# Altium project Brake_Light.PrjPcb
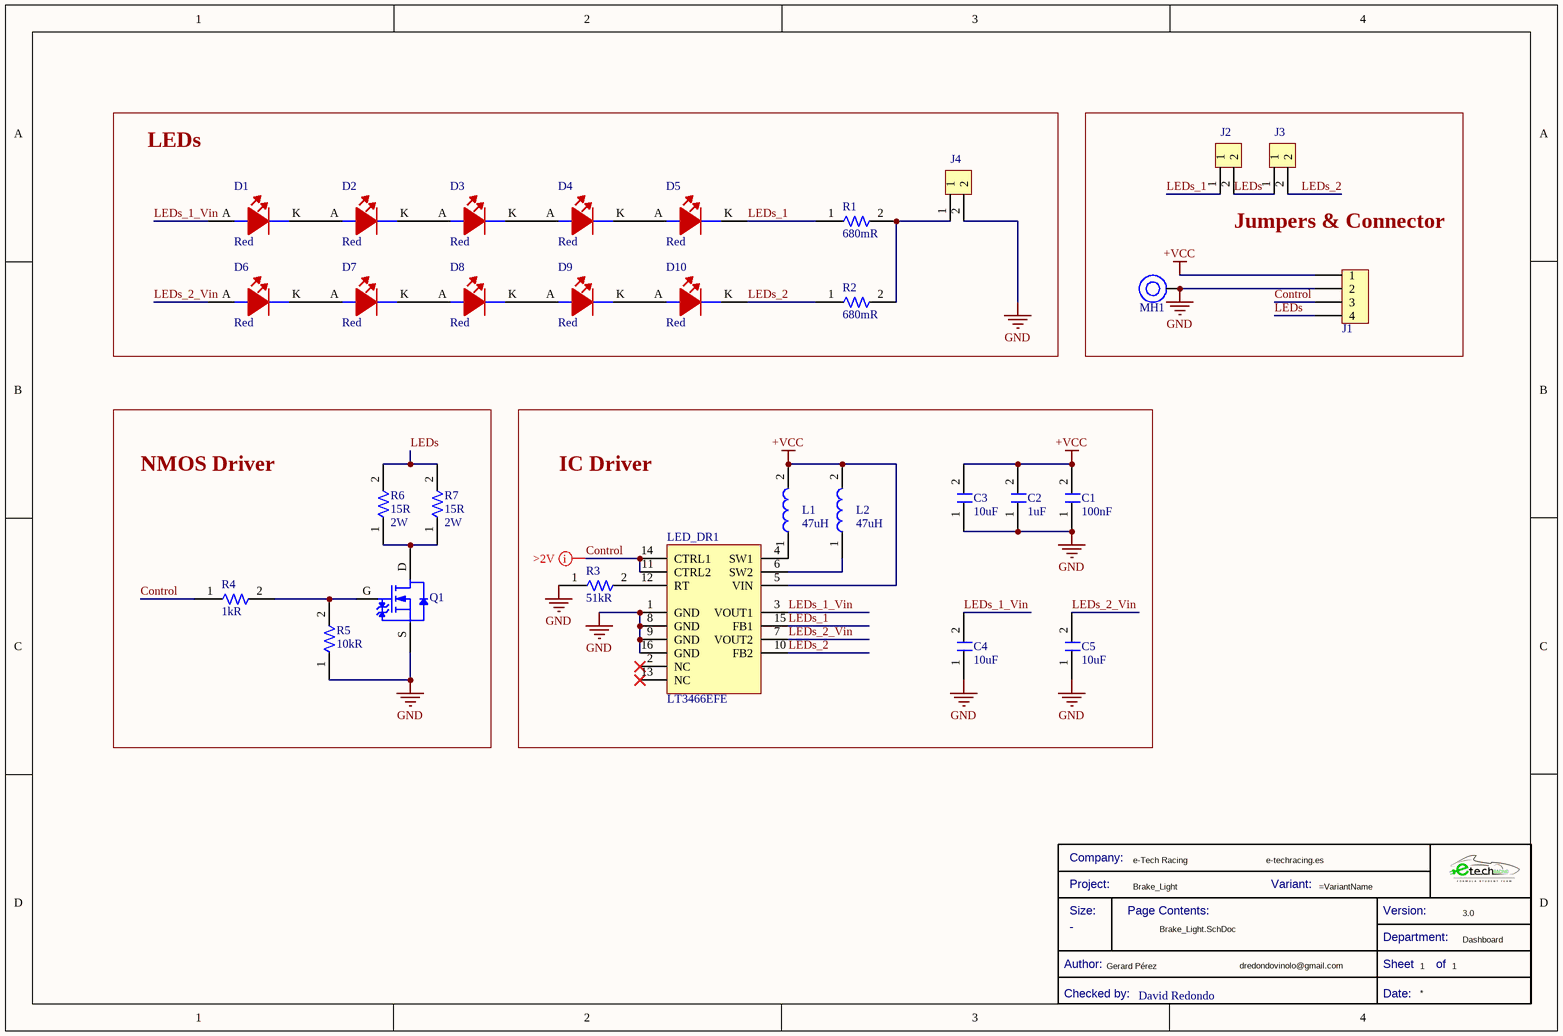
[diagram p0: Brake_Light.SchDoc]
Company: e-Tech Racing; Department: Dashboard; DesignedByURL: e-techracing.es; DesignerMail: dredondovinolo@gmail.com; DesignerName: Gerard Pérez; Project: Brake_Light; ReviewerName: David Redondo; Version: 3.0
1 sheet, 32 parts. Net scope: global (net labels, ports and power ports of the same name join across sheets).
Board file: Brake_Light.PcbDoc

## Sheet Brake_Light.SchDoc
size A4; SheetNumber: 1; SheetTotal: 1

### Parts
*?  Checked by:: David Redondo  (hidden comment: Title Block_template)  (graphical)
C1  Capacitance: 100nF  [C0805FNPC-R]  (hidden comment: 885012207098)
C2  Capacitance: 1uF  [C0805FNPC-R]  (hidden comment: 885012207103)
C3  Capacitance: 10uF  [C10u-50V-1210FNPMLCC-X7R]  (hidden comment: GRJ32ER71H106KE11L)
C4  Capacitance: 10uF  [C10u-50V-1210FNPMLCC-X7R]  (hidden comment: GRJ32ER71H106KE11L)
C5  Capacitance: 10uF  [C10u-50V-1210FNPMLCC-X7R]  (hidden comment: GRJ32ER71H106KE11L)
D1  Color: Red  [LED_3535_WE]  (hidden comment: 150353RS74500)
D2  Color: Red  [LED_3535_WE]  (hidden comment: 150353RS74500)
D3  Color: Red  [LED_3535_WE]  (hidden comment: 150353RS74500)
D4  Color: Red  [LED_3535_WE]  (hidden comment: 150353RS74500)
D5  Color: Red  [LED_3535_WE]  (hidden comment: 150353RS74500)
D6  Color: Red  [LED_3535_WE]  (hidden comment: 150353RS74500)
D7  Color: Red  [LED_3535_WE]  (hidden comment: 150353RS74500)
D8  Color: Red  [LED_3535_WE]  (hidden comment: 150353RS74500)
D9  Color: Red  [LED_3535_WE]  (hidden comment: 150353RS74500)
D10  Color: Red  [LED_3535_WE]  (hidden comment: 150353RS74500)
J1  1053131204  [J_NanoFit_1x4]  (value not drawn)
J2  61300211121  [J_Pinheader_1x2]  (value not drawn)
J3  61300211121  [J_Pinheader_1x2]  (value not drawn)
J4  61300211121  [J_Pinheader_1x2]  (value not drawn)
L1  Inductance: 47uH  [L_47u-490mA_CF]  (hidden comment: CDC5D23BNP-470KC)
L2  Inductance: 47uH  [L_47u-490mA_CF]  (hidden comment: CDC5D23BNP-470KC)
LED_DR1  Supplier Part Number 1: LT3466EFE  [LED_Driver_300mA_2Outputs]  (hidden comment: LT3466)
MH1  Mounting_Hole_M3  [Mounting_Hole_M3]  (value not drawn)
Q1  SQ2318BES-T1_GE3  [TRT-NCH-D2PAK]  (value not drawn)
R1  Resistance: 680mR  [R1206FTK-W]  (hidden comment: R68m-1206FTK)
R2  Resistance: 680mR  [R1206FTK-W]  (hidden comment: R68m-1206FTK)
R3  Resistance: 51kR  [R1206FTK-W]  (hidden comment: CRCW120610K0FKEA)
R4  Resistance: 1kR  [R0805FTK]  (hidden comment: CR0805-JW-102ELF)
R5  Resistance: 10kR  [R0805FTK]  (hidden comment: CR0805-JW-103ELF)
R6  value 15R  Max Power Dissipation: 2W  [R2512FTK]  (hidden comment: 352115RFT)
R7  value 15R  Max Power Dissipation: 2W  [R2512FTK]  (hidden comment: 352115RFT)

### Blocks framed on the sheet
LEDs: D1-D10 J4 R1 R2
Jumpers & Connector: J1-J3 MH1
NMOS Driver: Q1 R4-R7
IC Driver: C1-C5 L1 L2 LED_DR1 R3

### Nets
+VCC: C1.2 C2.2 C3.2 J1.1 L1.2 L2.2 LED_DR1.5(VIN)
GND: C1.1 C2.1 C3.1 C4.1 C5.1 J1.2 J4.2 LED_DR1.1(GND) LED_DR1.8(GND) LED_DR1.9(GND) LED_DR1.16(GND) MH1.1 Q1.S R3.1 R5.1
Control: J1.3 LED_DR1.11(CTRL2) LED_DR1.14(CTRL1) R4.1
LEDs: J1.4 J2.2 J3.1 R6.2 R7.2
LEDs_1: D5.K J2.1 LED_DR1.15(FB1) R1.1
LEDs_1_Vin: C4.2 D1.A LED_DR1.3(VOUT1)
LEDs_2: D10.K J3.2 LED_DR1.10(FB2) R2.1
LEDs_2_Vin: C5.2 D6.A LED_DR1.7(VOUT2)
NetD1_K: D1.K D2.A
NetD2_K: D2.K D3.A
NetD3_K: D3.K D4.A
NetD4_K: D4.K D5.A
NetD6_K: D6.K D7.A
NetD7_K: D7.K D8.A
NetD8_K: D8.K D9.A
NetD9_K: D9.K D10.A
NetJ4_1: J4.1 R1.2 R2.2
NetL1_1: L1.1 LED_DR1.4(SW1)
NetL2_1: L2.1 LED_DR1.6(SW2)
NetLED_DR1_12: LED_DR1.12(RT) R3.2
NetQ1_D: Q1.D R6.1 R7.1
NetQ1_G: Q1.G R4.2 R5.2

Not connected (* = marked no-connect by the designer): LED_DR1 2(NC)* 13(NC)*

### Layout directives
mark named >2V: Control

### Notes on the sheet
- (in symbol Title Block_template) Company:; Project:; Variant:; Size:; Page Contents:; Version:; Department:; Author:; Sheet; of; Checked by:; Date:

### Library data of the parts
*? = Title Block_template: Standard Title Block; .Creator: GP; Category: Title Block; .PCBcheck: GP; .SCHcheck: GP; Size: -
C1 = C100n-50V-0805FNPC-X7R: Cap, 0.1ΜF, 50V, 10%, X7R, 0805; Manufacturer 1: Wurth Electronics; .Creator: DR; Supplier 1: RSComponents; Manufacturer Part Number 1: 885012207098; RoHS: Yes; Category: Ceramic Capacitors; Stock 1: 8000; Pricing 1: 100=0,10200, 500=0,07100, 2000=0,06100 (GBP); Mount: Surface Mount; Case/Package: 0805; Case Code (Metric): 2012; Case Code (Imperial): 0805; Min Operating Temperature: -55°C; Max Operating Temperature: 125°C; Packaging: Cut Tape; Voltage Rating: 50V; Dielectric: X7R; Tolerance: 10%; Voltage Rating (DC): 50V; Length: 0.079inch; Width: 0.049inch; Thickness: 0.035inch; REACH SVHC: Unknown; RoHS Compliant: Yes; ComponentLink1URL: http://www.farnell.com/datasheets/1958498.pdf?src-supplier=Farnell; ComponentLink1Description: http://www.farnell.com/datasheets/1958498.pdf?src-supplier=Farnell; ComponentLink2URL: http://www.farnell.com/datasheets/1958498.pdf?src-supplier=Element14; ComponentLink2Description: http://www.farnell.com/datasheets/1958498.pdf?src-supplier=Element14; ComponentLink3URL: https://katalog.we-online.de/pbs/datasheet/885012207098.pdf?src-supplier=Digi-Key; ComponentLink3Description: https://katalog.we-online.de/pbs/datasheet/885012207098.pdf?src-supplier=Digi-Key; ComponentLink4URL: http://www.farnell.com/datasheets/1958498.pdf?src-supplier=Newark; ComponentLink4Description: http://www.farnell.com/datasheets/1958498.pdf?src-supplier=Newark; Supplier Part Number 1: 1813493
C2 = C1u-50V-0805FNPC-X7R: Multilayer Ceramic Capacitor, Wcap-Csgp Series, 1 F, 10%, X7R, 50 V, 0805 [2012 Metric] Rohs Compliant: Yes; Manufacturer 1: Wurth Electronics; Voltage Rating: 50V; .Creator: GP; Supplier 1: RSComponents; Manufacturer Part Number 1: 885012207103; RoHS: Yes; Category: Ceramic Capacitors; Stock 1: 5100; Pricing 1: 50=0,27200, 250=0,25300, 500=0,22800, 1250=0,20100, 2500=0,17100 (GBP); Mount: Surface Mount; Case/Package: 0805; Case Code (Metric): 2012; Case Code (Imperial): 0805; Min Operating Temperature: -55°C; Max Operating Temperature: 85°C; Packaging: Cut Tape; Dielectric: X7R; Tolerance: 10%; Voltage Rating (DC): 50V; Length: 0.079inch; Width: 0.049inch; Thickness: 0.053inch; REACH SVHC: Unknown; RoHS Compliant: Yes; ComponentLink1URL: http://www.farnell.com/datasheets/1958501.pdf?src-supplier=Farnell; ComponentLink1Description: http://www.farnell.com/datasheets/1958501.pdf?src-supplier=Farnell; ComponentLink2URL: http://www.farnell.com/datasheets/1958501.pdf?src-supplier=Element14; ComponentLink2Description: http://www.farnell.com/datasheets/1958501.pdf?src-supplier=Element14; ComponentLink3URL: https://katalog.we-online.de/pbs/datasheet/885012107003.pdf?src-supplier=Digi-Key; ComponentLink3Description: https://katalog.we-online.de/pbs/datasheet/885012107003.pdf?src-supplier=Digi-Key; ComponentLink4URL: http://www.farnell.com/datasheets/1958501.pdf?src-supplier=Newark; ComponentLink4Description: http://www.farnell.com/datasheets/1958501.pdf?src-supplier=Newark; Supplier Part Number 1: 1813523
C3-C5 = C10u-50V-1210FNPMLCC-X7R: Multilayer Ceramic Capacitors MLCC - SMD/SMT 1210 10uF 50volts X7R +/-10% Soft Term; Manufacturer: Murata; Voltage Rating: 50V; Tolerance: 10%; .Creator: DR; Supplier 1: Avnet; Manufacturer Part Number: GRJ32ER71H106KE11L; RoHS: Yes; Category: Ceramic Capacitors; Stock 1: 19000; Pricing 1: 1000=0,33327, 2000=0,32389, 4000=0,31450, 6000=0,30511, 8000=0,29572 (USD); Mount: Surface Mount; Case/Package: 1210; Case Code (Metric): 3225; Case Code (Imperial): 1210; Min Operating Temperature: -55°C; Max Operating Temperature: 125°C; Packaging: Tape and Reel; Features: Soft Termination; Length: 0.126inch; Width: 0.098inch; Thickness: 0.11inch; RoHS Compliant: Yes; ComponentLink1URL: https://eu.mouser.com/datasheet/2/281/GRJ32ER71H106KE11_01-1977929.pdf; ComponentLink1Description: Datasheet; Supplier Part Number 1: GRJ32ER71H106KE11L
D1-D10 = LEDRS-3535-55: High Brightness Led, Wl-Smdc Series, 625 Nm, Red, 55 Lm, 350 Ma; Manufacturer: Wurth Electronics; Forward Current: 700mA; Wavelength: 625nm; Test Temperature: 25°C; Viewing Angle: 125°; Thermal Resistance of Package: 10°C/W; Luminous Flux: 55lm; Test Current: 350mA; Forward Voltage: 2.2V; .Creator: GP; Supplier 1: RSComponents; Manufacturer Part Number: 150353RS74500; RoHS: Yes; Stock 1: 1; Pricing 1: 5=1,40500 (USD); Mount: Surface Mount; Case/Package: SMD/SMT; Packaging: Cut Tape; Max Current Rating: 700mA; REACH SVHC: Unknown; RoHS Compliant: Yes; ComponentLink1URL: http://www.farnell.com/datasheets/1886833.pdf?src-supplier=Farnell; ComponentLink1Description: http://www.farnell.com/datasheets/1886833.pdf?src-supplier=Farnell; ComponentLink2URL: http://www.farnell.com/datasheets/1886833.pdf?src-supplier=Element14; ComponentLink2Description: http://www.farnell.com/datasheets/1886833.pdf?src-supplier=Element14; Supplier Part Number 1: 9008911; ComponentLink3Description: Where buy it; ComponentLink3URL: https://www.we-online.com/catalog/en/WL-SMDC?sq=150353rs74500&sp=https%3A%2F%2Fwww.we-online.com%2Fweb%2Fen%2Fwuerth_elektronik%2Fsearchpage.php%3Fsearch%3D150353rs74500#150353RS74500
J1 = J_NanoFit_1x4: Nano-Fit Right Angle Header; Through Hole; 2.50mm; Single Row; 4 Circuit; Gold Plated; Manufacturer: Molex; Manufacturer Part Number: 105313-1204; Gender: Male; .Creator: DO; Supplier 1: RSComponents; RoHS: Yes; Category: Headers and Wire Housings; Stock 1: 286; Pricing 1: 10=1,14100, 50=0,65100, 100=0,63400, 250=0,61700, 500=0,60100 (GBP); Mount: Through Hole; Contact Plating: Gold; Contact Material: Brass; Color: Black; Termination: Through Hole; Number of Rows: 1; REACH SVHC: Unknown; RoHS Compliant: Yes; ComponentLink1URL: http://www.farnell.com/datasheets/2216599.pdf?src-supplier=Farnell; ComponentLink1Description: http://www.farnell.com/datasheets/2216599.pdf?src-supplier=Farnell; ComponentLink2URL: http://www.farnell.com/datasheets/2216599.pdf?src-supplier=Element14; ComponentLink2Description: http://www.farnell.com/datasheets/2216599.pdf?src-supplier=Element14; ComponentLink3URL: http://www.farnell.com/datasheets/2216599.pdf?src-supplier=Newark; ComponentLink3Description: http://www.farnell.com/datasheets/2216599.pdf?src-supplier=Newark; ComponentLink4URL: https://www.molex.com/pdm_docs/sd/1053131102_sd.pdf?src-supplier=Digi-Key; ComponentLink4Description: https://www.molex.com/pdm_docs/sd/1053131102_sd.pdf?src-supplier=Digi-Key; Supplier Part Number 1: 1225085
J2-J4 = J_Jumper: CONN HEADER 2 POS 2.54; Manufacturer: Molex; Temperature rating: -40° to +105°C; Category type: PCB-PCB; Product name: Pin Header; Maximum current: 3 A; Maximum voltage: 250 V AC; Connections: 1x2; Current Rating: 3A; Voltage Rating: 250V; Number of Positions: 2; Gender: Male; Connector Type: Male Pin; Pitch: 0.1inch; .Creator: GP; Category: Connector; ComponentLink1Description: Datasheet; ComponentLink1URL: https://www.we-online.com/catalog/datasheet/61300211121.pdf; ComponentLink2Description: Where buy it; ComponentLink2URL: https://www.we-online.com/catalog/en/PHD_2_54_THT_PIN_HEADER_6130XX11121?sq=61300211121&sp=https%3A%2F%2Fwww.we-online.com%2Fweb%2Fen%2Fwuerth_elektronik%2Fsearchpage.php%3Fsearch%3D61300211121#61300211121; Manufacturer part number: 61300211121; Supplier: Würth Elektronik; RoHS: *; Application: Shortcircuit; Flammability: 94V-0; Orientation: Vertical; Mount: Through hole; Supplier 1: RSComponents; Stock 1: 1855; Pricing 1: 5=0,14100, 50=0,09700, 100=0,07800, 200=0,07300, 500=0,06800 (USD); Contact Plating: Gold; Housing Material: PBT; Contact Material: Copper Alloy,Copper; Color: Black; Min Operating Temperature: -40°C; Max Operating Temperature: 125°C; Number of Rows: 1; Contact Gender: Male; Packaging: Bulk; Termination: Through Hole; Number of Contacts: 2; Contact Mating Length: 0.236inch; REACH SVHC: Unknown; Lead Free: Lead Free; ComponentLink3URL: https://datasheet.ciiva.com/13619/6130xx11121-48870-13619345.pdf?src-supplier=Mouser; ComponentLink3Description: https://datasheet.ciiva.com/13619/6130xx11121-48870-13619345.pdf?src-supplier=Mouser; Supplier Part Number 1: 8281581
L1 L2 = L_47u-490mA_CF: Inductor Power Unshielded Wirewound 47uH 10% 100KHz Ferrite 490mA 546mOhm DCR T/R; Manufacturer: Sumida; DC Resistance (DCR): 546mR; .Creator: GP; Supplier 1: Mouser; Manufacturer Part Number: CDC5D23BNP-470KC; RoHS: Yes; Category: Fixed Inductors; Stock 1: 3779; Pricing 1: 1=0,95000, 10=0,71100, 50=0,71100, 100=0,59700, 1000=0,40600, 10000=0,38100 (USD); Mount: Surface Mount; Case/Package: Nonstandard; Core Material: Ferrite; Weight: 0.007584oz; Min Operating Temperature: -40°C; Max Operating Temperature: 100°C; Tolerance: 10%; Shielding: Unshielded; Packaging: Tape and Reel; Package Quantity: 2000; Current Rating: 490mA; Max DC Current: 490mA; Termination: SMD/SMT; Test Frequency: 100kHz; Series: CDC5D23B; Length: 0.228inch; Width: 5.8mm; Height: 2.5mm; Height - Seated (Max): 0.098inch; Lead Free: Lead Free; RoHS Compliant: Yes; ComponentLink1URL: http://www.mouser.com/ds/2/390/CDC5D23B-465898.pdf?src-supplier=Mouser; ComponentLink1Description: http://www.mouser.com/ds/2/390/CDC5D23B-465898.pdf?src-supplier=Mouser; ComponentLink3URL: http://products.sumida.com/products/pdf/CDC5D23B.pdf?src-supplier=Digi-Key; ComponentLink3Description: http://products.sumida.com/products/pdf/CDC5D23B.pdf?src-supplier=Digi-Key; Supplier Part Number 1: 851-CDC5D23BNP-470KC
LED_DR1 = LED_Driver_300mA_2Outputs: LT3466 - Dual Full Function White LED Step-Up Converter with Built-In Schottky Diodes; Manufacturer: Analog Devices / Linear Technology; Min Input Voltage: 2.7V; Topology: Boost; Max Supply Voltage: 24V; Number of Segments: 20; .Creator: GP; Supplier 1: Arrow Electronics; Manufacturer Part Number: LT3466EFE; RoHS: No; Number of Pins: 16; Min Operating Temperature: -40°C; Max Operating Temperature: 85°C; Min Supply Voltage: 2.7V; RoHS Compliant: No; ComponentLink1URL: https://eu.mouser.com/datasheet/2/609/3466fa-1271503.pdf; ComponentLink1Description: Datasheet; ComponentLink2Description: Where buy it; ComponentLink2URL: *
Q1 = TRT-NCH-31/100: MOSFET N-CH 100V 31A DPAK; Manufacturer 1: Infineon; Manufacturer Part Number 1: IRFR3410TRPBF; Power Dissipation: 110W; Gate to Source Voltage (Vgs): 20V; Rds On Max: 39mR; Input Capacitance: 1.69nF; Max Power Dissipation: 3W; Turn-Off Delay Time: 40ns; Turn-On Delay Time: 12ns; Threshold Voltage: 4V; Polarization: N; ComponentLink2Description: Datasheet; ComponentLink2URL: https://www.mouser.es/datasheet/2/427/sq2318bes-1868475.pdf; Supplier 1: Farnell; RoHS: Yes; Category: MOSFETs; Stock 1: 4070; Pricing 1: 1=1,20000, 10=1,08000, 100=0,84200, 500=0,69600 (EUR); Mount: Surface Mount; Case/Package: TO-252-3; Number of Pins: 3; Min Operating Temperature: -55°C; Max Operating Temperature: 175°C; Continuous Drain Current (ID): 31A; Packaging: Cut Tape; Drain to Source Voltage (Vdss): 100V; Drain to Source Resistance: 39mR; Drain to Source Breakdown Voltage: 100V; Series: HEXFET®; Max Dual Supply Voltage: 100V; Length: 0.264inch; Width: 0.245inch; Height: 0.094inch; Lead Free: Contains Lead; RoHS Compliant: Yes; Reach SVHC Compliant: Yes; Halogen Free: Halogen Free; Supplier Part Number 1: 2468036
R1 R2 = R68m-1206FTK: Thick Film Surface Mount Chip Resistor 1206 Size 0.68 Ohm 5% 0.5 W ±100 ppm/°C 2-Pin SMD T/R; Manufacturer 1: Vishay; Manufacturer Part Number 1: RCWE1206R680JKEA; Max Power Dissipation: 500mW; Supplier 1: Avnet; RoHS: Yes; Category: Chip SMD Resistors; Pricing 1: 5000=0,23581, 10000=0,22825, 20000=0,22069, 30000=0,21313, 40000=0,20488, 50000=0,19525, 500000=0,18563 (USD); Case/Package: 1206; Min Operating Temperature: -55°C; Max Operating Temperature: 155°C; Tolerance: 5%; Resistor Type: Thick Film; Packaging: Tape and Reel; Number of Terminations: 2; Temperature Coefficient: 100ppm/°C; Features: Moisture Resistant,Automotive AEC-Q200; Length: 0.122inch; Width: 0.063inch; Height: 0.028inch; Depth: 1.6mm; Military Standard: Not; RoHS Compliant: Yes; ComponentLink1URL: http://www.vishay.com/docs/20019/rcwe.pdf?src-supplier=Digi-Key; ComponentLink1Description: http://www.vishay.com/docs/20019/rcwe.pdf?src-supplier=Digi-Key; Supplier Part Number 1: RCWE1206R680JKEA
R3 = R51k-1206FTK: Res Thick Film 1206 51K Ohm 1% 1/4W ±100ppm/°C Molded SMD SMD Punched Carrier T/R; Manufacturer: Panasonic; Manufacturer Part Number: ERJ-S08F5102V; Power Rating: 250mW; Voltage Rating: 150V; Voltage Rating (DC): 200V; Current Rating: 2A; .Creator: DO; Category: Resistor; ComponentLink1Description: Datasheet; ComponentLink1URL: https://docs.rs-online.com/bca8/A700000006404581.pdf; ComponentLink2Description: Where buy it; ComponentLink2URL: https://es.rs-online.com/web/p/resistencias-de-montaje-en-superficie/6791765; Supplier 1: Mouser; RoHS: Yes; Stock 1: 4091; Pricing 1: 1=0,31000, 10=0,26700, 50=0,26700, 100=0,10700, 1000=0,05100, 10000=0,03400 (USD); Mount: Surface Mount; Case/Package: 1206; Case Code (Metric): 3216; Case Code (Imperial): 1206; Contact Plating: Tin; Min Operating Temperature: -55°C; Max Operating Temperature: 155°C; Packaging: Tape and Reel; Tolerance: 1%; Package Quantity: 5000; Resistor Type: Thick Film; Number of Terminations: 2; Temperature Coefficient: 100ppm/°C; Max Power Dissipation: 250mW; Features: Anti-Sulfur; Series: ERJ; Construction: Rectangular; Length: 3.2mm; Width: 0.063inch; Height: 0.028inch; Depth: 1.6mm; Military Standard: Not; Lead Free: Lead Free; RoHS Compliant: Yes; ComponentLink3URL: https://datasheet.ciiva.com/24023/aoa0000ce5-24023518.pdf?src-supplier=Mouser; ComponentLink3Description: https://datasheet.ciiva.com/24023/aoa0000ce5-24023518.pdf?src-supplier=Mouser; ComponentLink4URL: https://datasheet.ciiva.com/9189/aoa0000ce5-9189211.pdf?src-supplier=Avnet; ComponentLink4Description: https://datasheet.ciiva.com/9189/aoa0000ce5-9189211.pdf?src-supplier=Avnet; Supplier Part Number 1: 667-ERJ-S08F5102V
R4 = R1k-0805FTK: Res Thick Film 0805 1K Ohm 5% 1/8W ±200ppm/°C Molded SMD SMD Paper Tape on Plastic Reel; Manufacturer 1: Bourns; Voltage Rating (DC): 150V; Power Rating: 125mW; .Creator: GP; Supplier 1: Arrow Electronics; Manufacturer Part Number 1: CR0805-JW-102ELF; RoHS: Yes; Category: Chip SMD Resistors; Stock 1: 27510; Pricing 1: 1=0,05930, 10=0,03510, 25=0,01790, 100=0,00800, 250=0,00790, 500=0,00590, 1000=0,00360, 3000=0,00350, 6000=0,00250 (USD); Mount: Surface Mount; Case/Package: 0805; Number of Pins: 2; Contact Plating: Tin; Case Code (Metric): 2012; Case Code (Imperial): 0805; Min Operating Temperature: -55°C; Max Operating Temperature: 155°C; Resistor Type: Thick Film; Tolerance: 5%; Temperature Coefficient: 200ppm/°C; Features: Moisture Resistant; Package Quantity: 1; Packaging: Tape and Reel; Voltage Rating: 150V; Number of Terminations: 2; Termination: SMD/SMT; Max Power Dissipation: 125mW; Length: 2mm; Width: 1.25mm; Height: 0.5mm; Thickness: 508um; Depth: 1.25mm; Radiation Hardening: No; Lead Free: Lead Free; REACH SVHC: No SVHC; Military Standard: Not; ComponentLink1URL: https://datasheet.ciiva.com/11821/0900766b80fcdb72-11821134.pdf?src-supplier=RSComponents; ComponentLink1Description: https://datasheet.ciiva.com/11821/0900766b80fcdb72-11821134.pdf?src-supplier=RSComponents; ComponentLink2URL: https://datasheet.ciiva.com/15225/getdatasheetpartid-78155-15225381.pdf?src-supplier=Verical; ComponentLink2Description: https://datasheet.ciiva.com/15225/getdatasheetpartid-78155-15225381.pdf?src-supplier=Verical; ComponentLink3URL: https://datasheet.ciiva.com/22693/1902866-22693253.pdf?src-supplier=Element14; ComponentLink3Description: https://datasheet.ciiva.com/22693/1902866-22693253.pdf?src-supplier=Element14; ComponentLink4URL: https://datasheet.ciiva.com/7986/1856384-7986184.pdf?src-supplier=Element14; ComponentLink4Description: https://datasheet.ciiva.com/7986/1856384-7986184.pdf?src-supplier=Element14; ComponentLink5URL: https://datasheet.ciiva.com/7985/1856384-7985867.pdf?src-supplier=Element14; ComponentLink5Description: https://datasheet.ciiva.com/7985/1856384-7985867.pdf?src-supplier=Element14; ComponentLink6URL: https://datasheet.ciiva.com/30242/159chpreztr-30242765.pdf?src-supplier=Onlinecomponents.com; ComponentLink6Description: https://datasheet.ciiva.com/30242/159chpreztr-30242765.pdf?src-supplier=Onlinecomponents.com; ComponentLink7URL: https://datasheet.ciiva.com/6547/chpreztr-6547359.pdf?src-supplier=Digi-Key; ComponentLink7Description: https://datasheet.ciiva.com/6547/chpreztr-6547359.pdf?src-supplier=Digi-Key; Supplier Part Number 1: CR0805-JW-102ELF
R5 = R10k-0805FTK: BOURNS         CR0805-JW-103ELF            Surface Mount Chip Resistor, Thick Film, CR Series, 10 kohm, 125 mW,  5%, 150 V; Temperature Coefficient: 200ppm/°C; Power Rating: 125mW; Voltage Rating: 150V; Voltage Rating (DC): 100V; .Creator: DR; Supplier 1: Arrow Electronics; Manufacturer 1: Bourns; Manufacturer Part Number 1: CR0805-JW-103ELF; RoHS: Yes; Category: Chip SMD Resistors; Stock 1: 57566; Pricing 1: 1=0,05790, 10=0,01540, 25=0,01340, 100=0,00340 (USD); Mount: Surface Mount; Case/Package: 0805; Number of Pins: 2; Contact Plating: Tin; Case Code (Metric): 2012; Case Code (Imperial): 0805; Min Operating Temperature: -55°C; Max Operating Temperature: 155°C; Tolerance: 5%; Resistor Type: Thick Film; Package Quantity: 1; Packaging: Tape and Reel; Number of Terminations: 2; Termination: SMD/SMT; Max Power Dissipation: 125mW; Features: Moisture Resistant; Series: CR0805; Construction: Rectangular; Resistance Tolerance: 5%; Technology: THICK FILM; Length: 2mm; Width: 1.25mm; Height: 0.5mm; Depth: 1.25mm; Thickness: 508um; Radiation Hardening: No; REACH SVHC: No SVHC; Military Standard: Not; RoHS Compliant: Yes; ComponentLink1URL: https://datasheet.ciiva.com/11821/0900766b80fcdb72-11821135.pdf?src-supplier=RSComponents; ComponentLink1Description: https://datasheet.ciiva.com/11821/0900766b80fcdb72-11821135.pdf?src-supplier=RSComponents; ComponentLink2URL: https://datasheet.ciiva.com/9122/chpreztr-9122374.pdf?src-supplier=Avnet; ComponentLink2Description: https://datasheet.ciiva.com/9122/chpreztr-9122374.pdf?src-supplier=Avnet; ComponentLink3URL: https://datasheet.ciiva.com/22693/1902866-22693254.pdf?src-supplier=Element14; ComponentLink3Description: https://datasheet.ciiva.com/22693/1902866-22693254.pdf?src-supplier=Element14; ComponentLink4URL: https://datasheet.ciiva.com/7986/691949-7986187.pdf?src-supplier=Element14; ComponentLink4Description: https://datasheet.ciiva.com/7986/691949-7986187.pdf?src-supplier=Element14; ComponentLink5URL: https://datasheet.ciiva.com/30065/159chpreztr-30065976.pdf?src-supplier=Onlinecomponents.com; ComponentLink5Description: https://datasheet.ciiva.com/30065/159chpreztr-30065976.pdf?src-supplier=Onlinecomponents.com; ComponentLink6URL: https://datasheet.ciiva.com/16783/70154685-16783482.pdf?src-supplier=Allied+Electronics; ComponentLink6Description: https://datasheet.ciiva.com/16783/70154685-16783482.pdf?src-supplier=Allied+Electronics; ComponentLink7URL: https://datasheet.ciiva.com/5548/chpreztr-5548491.pdf?src-supplier=Mouser; ComponentLink7Description: https://datasheet.ciiva.com/5548/chpreztr-5548491.pdf?src-supplier=Mouser; ComponentLink8URL: https://datasheet.ciiva.com/6559/chpreztr-6559900.pdf?src-supplier=Digi-Key; ComponentLink8Description: https://datasheet.ciiva.com/6559/chpreztr-6559900.pdf?src-supplier=Digi-Key; ComponentLink9URL: https://datasheet.ciiva.com/6559/chpreztr-6559901.pdf?src-supplier=Digi-Key; ComponentLink9Description: https://datasheet.ciiva.com/6559/chpreztr-6559901.pdf?src-supplier=Digi-Key; ComponentLink10URL: https://datasheet.ciiva.com/7985/1856384-7985869.pdf?src-supplier=Element14; ComponentLink10Description: https://datasheet.ciiva.com/7985/1856384-7985869.pdf?src-supplier=Element14; ComponentLink11URL: https://datasheet.ciiva.com/48692/001055517-da-01-en-smd-wid-cr0805-jw-103elf-10k-ohm-1-8w-48692118.pdf?src-supplier=Conrad; ComponentLink11Description: https://datasheet.ciiva.com/48692/001055517-da-01-en-smd-wid-cr0805-jw-103elf-10k-ohm-1-8w-48692118.pdf?src-supplier=Conrad; Supplier Part Number 1: CR0805-JW-103ELF
R6 R7 = R15-2512FTK: Res Thick Film 2512 15 Ohm 1% 2W ±100ppm/C Pad SMD T/R; Manufacturer 1: TE Connectivity; Temperature Coefficient: 100ppm/°C; Voltage Rating: 250V; Number of Resistors: 1; .Creator: DR; ComponentLink1Description: Datasheet; ComponentLink1URL: https://docs.rs-online.com/8bc1/0900766b81096b90.pdf; ComponentLink2Description: Where buy it; ComponentLink2URL: https://es.rs-online.com/web/p/resistencias-de-montaje-en-superficie/7551110; Supplier 1: RSComponents; Manufacturer Part Number 1: 352115RFT; RoHS: Yes; Category: Chip SMD Resistors; Stock 1: 1; Pricing 1: 10=0,64300, 250=0,62200, 1000=0,60000, 2000=0,55400, 2500=0,52100 (USD); Mount: Surface Mount; Case/Package: 2512; Case Code (Metric): 6432; Case Code (Imperial): 2512; Min Operating Temperature: -55°C; Max Operating Temperature: 155°C; Packaging: Tape and Reel; Tolerance: 1%; Resistor Type: Thick Film,Power resistor; Number of Terminations: 2; Termination: Solder; Voltage Rating (DC): 250V; Features: Automotive AEC-Q200; Series: 3521, CGS; Technology: THICK FILM; Resistance Tolerance: 1%; Length: 6.3mm; Height: 0.55mm; Depth: 3.2mm; RoHS Compliant: Yes; REACH SVHC: No SVHC; ELV: Compliant; ComponentLink3URL: https://datasheet.ciiva.com/25610/0900766b81096b90-25610033.pdf?src-supplier=RSComponents; ComponentLink3Description: https://datasheet.ciiva.com/25610/0900766b81096b90-25610033.pdf?src-supplier=RSComponents; ComponentLink4URL: https://datasheet.ciiva.com/46391/1610601-46391493.pdf?src-supplier=Element14; ComponentLink4Description: https://datasheet.ciiva.com/46391/1610601-46391493.pdf?src-supplier=Element14; ComponentLink5URL: https://datasheet.ciiva.com/7657/1610601-7657542.pdf?src-supplier=Element14; ComponentLink5Description: https://datasheet.ciiva.com/7657/1610601-7657542.pdf?src-supplier=Element14; Supplier Part Number 1: 7551110P